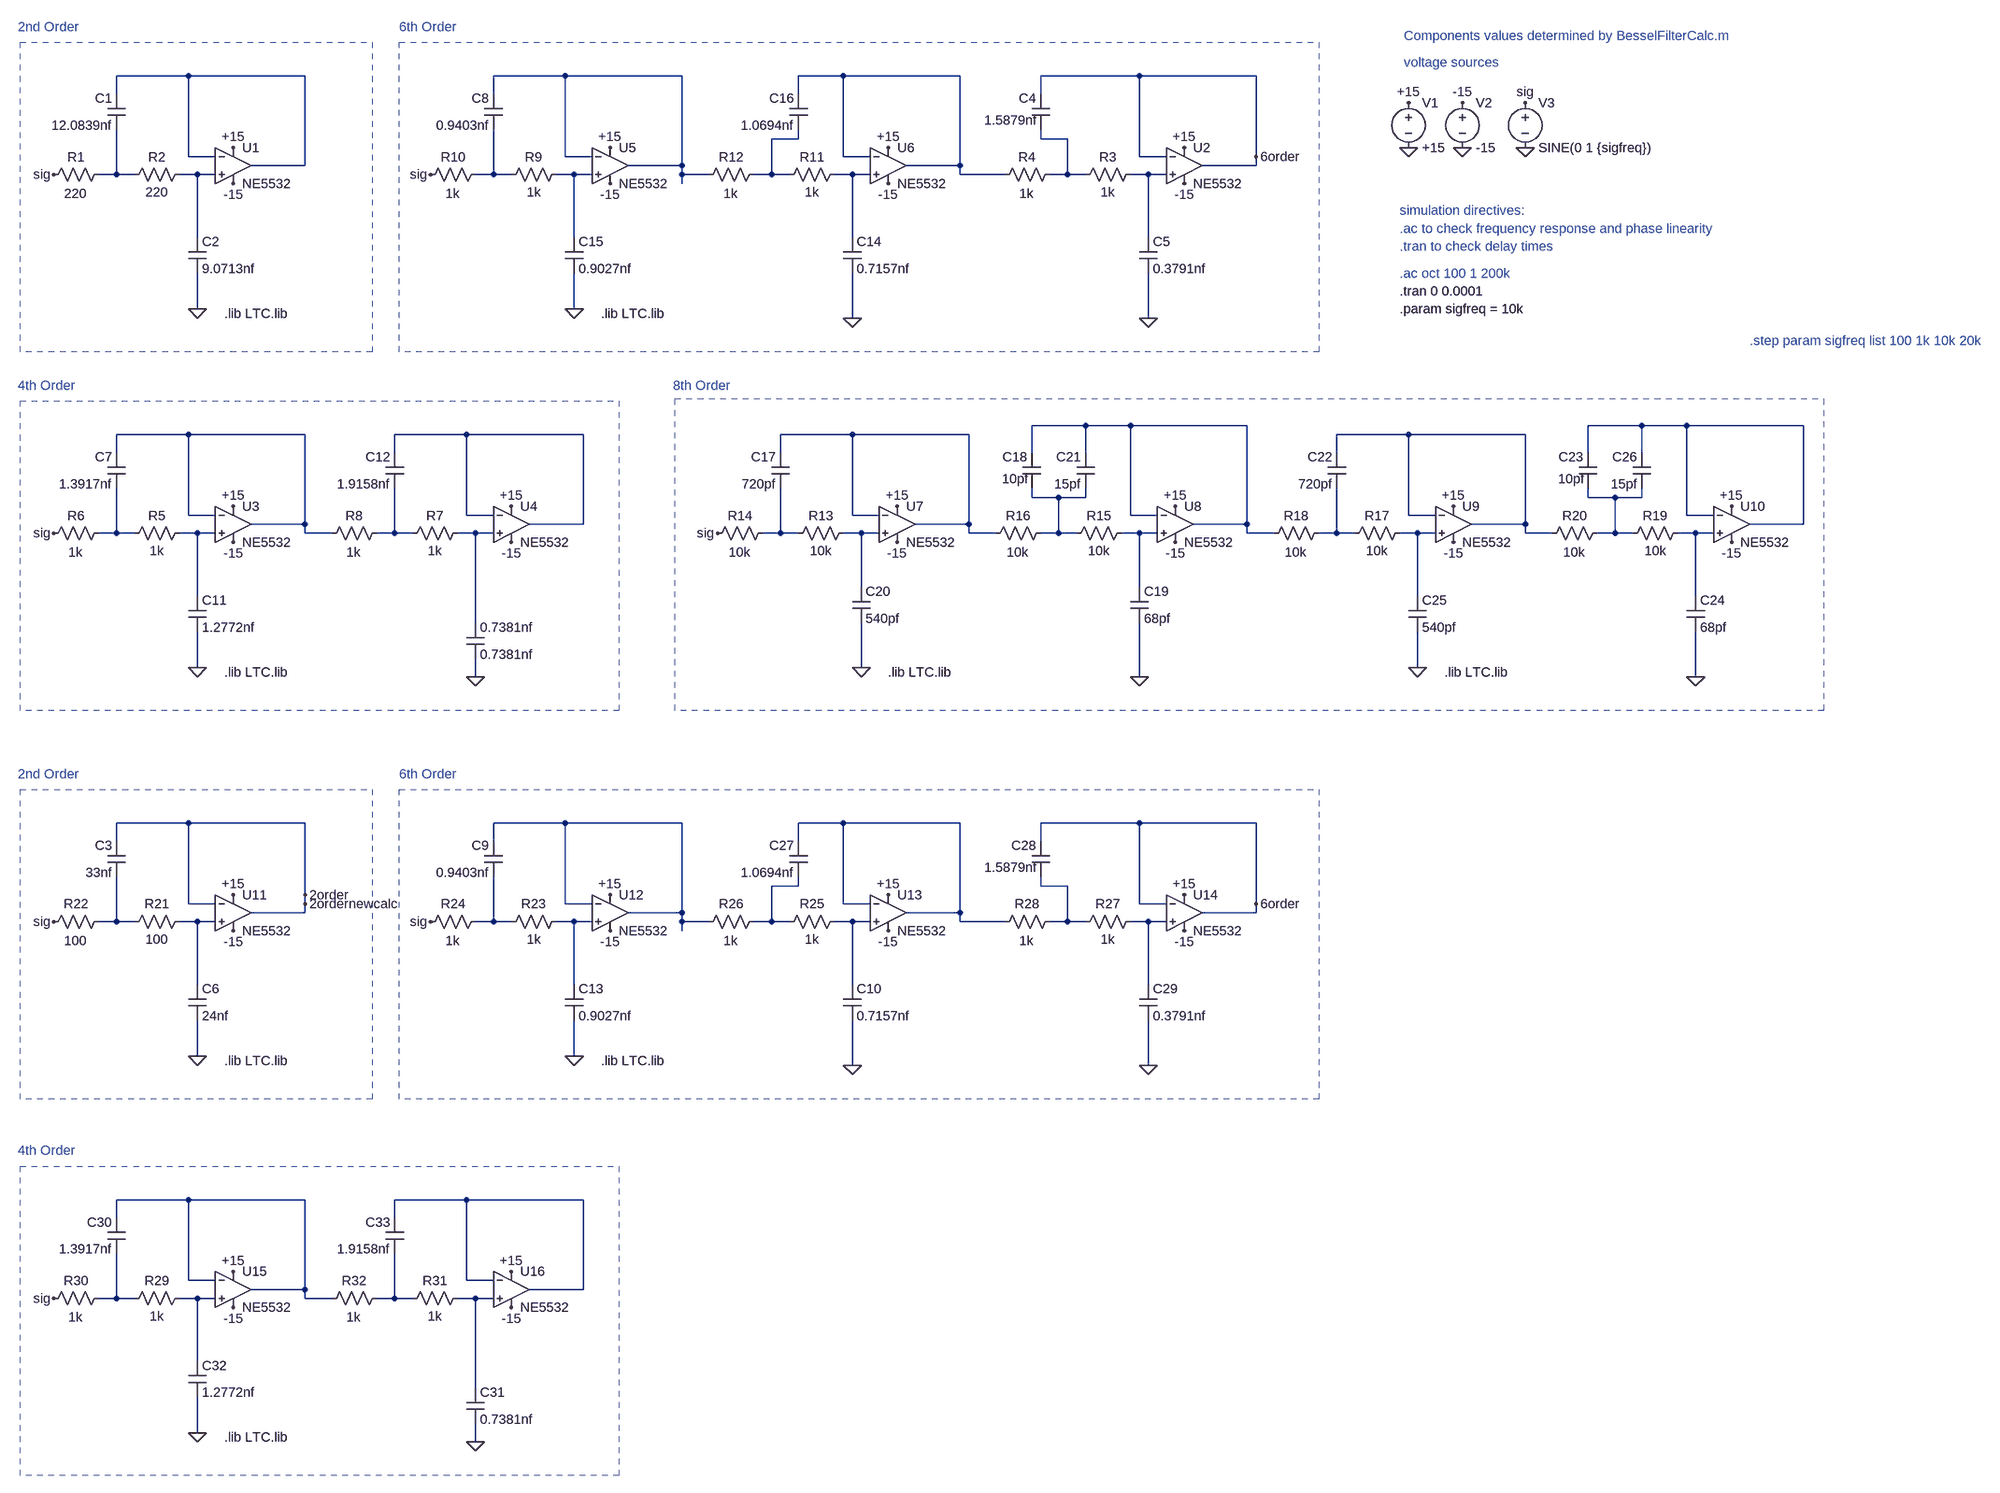
[diagram p0: schematic Bessel Filter.asc]
Bessel Filter.asc, the LTspice schematic file:
Version 4
SHEET 1 4128 2792
WIRE 912 -48 784 -48
WIRE 1120 -48 912 -48
WIRE 1584 -48 1456 -48
WIRE 1792 -48 1584 -48
WIRE 2080 -48 2000 -48
WIRE 2288 -48 2080 -48
WIRE 2608 -48 2432 -48
WIRE 2816 -48 2608 -48
WIRE 784 -16 784 -48
WIRE 1456 -16 1456 -48
WIRE 2000 -16 2000 -48
WIRE 2432 -16 2432 -48
WIRE 2000 64 2000 48
WIRE 2000 64 1952 64
WIRE 2432 64 2432 48
WIRE 2480 64 2432 64
WIRE 912 96 912 -48
WIRE 960 96 912 96
WIRE 1584 96 1584 -48
WIRE 1632 96 1584 96
WIRE 2080 96 2080 -48
WIRE 2128 96 2080 96
WIRE 2608 96 2608 -48
WIRE 2656 96 2608 96
WIRE 2816 96 2816 -48
WIRE 1120 112 1120 -48
WIRE 1120 112 1024 112
WIRE 1792 112 1792 -48
WIRE 1792 112 1696 112
WIRE 2288 112 2288 -48
WIRE 2288 112 2192 112
WIRE 2816 112 2816 96
WIRE 2816 112 2720 112
WIRE 784 128 784 48
WIRE 784 128 752 128
WIRE 816 128 784 128
WIRE 928 128 896 128
WIRE 960 128 928 128
WIRE 1456 128 1456 48
WIRE 1456 128 1424 128
WIRE 1488 128 1456 128
WIRE 1600 128 1568 128
WIRE 1632 128 1600 128
WIRE 1792 128 1792 112
WIRE 1840 128 1792 128
WIRE 1952 128 1952 64
WIRE 1952 128 1920 128
WIRE 1984 128 1952 128
WIRE 2096 128 2064 128
WIRE 2128 128 2096 128
WIRE 2288 128 2288 112
WIRE 2368 128 2288 128
WIRE 2480 128 2480 64
WIRE 2480 128 2448 128
WIRE 2512 128 2480 128
WIRE 2624 128 2592 128
WIRE 2656 128 2624 128
WIRE 1792 144 1792 128
WIRE 928 240 928 128
WIRE 1600 240 1600 128
WIRE 2096 240 2096 128
WIRE 2624 240 2624 128
WIRE 928 368 928 304
WIRE 1600 368 1600 304
WIRE 2096 384 2096 304
WIRE 2624 384 2624 304
WIRE 2512 576 2416 576
WIRE 2592 576 2512 576
WIRE 2800 576 2592 576
WIRE 3504 576 3408 576
WIRE 3584 576 3504 576
WIRE 3792 576 3584 576
WIRE 912 592 784 592
WIRE 1120 592 912 592
WIRE 1408 592 1280 592
WIRE 1616 592 1408 592
WIRE 2096 592 1968 592
WIRE 2304 592 2096 592
WIRE 3088 592 2960 592
WIRE 3296 592 3088 592
WIRE 784 624 784 592
WIRE 1280 624 1280 592
WIRE 1968 624 1968 592
WIRE 2416 624 2416 576
WIRE 2512 624 2512 576
WIRE 2960 624 2960 592
WIRE 3408 624 3408 576
WIRE 3504 624 3504 576
WIRE 2416 704 2416 688
WIRE 2464 704 2416 704
WIRE 2512 704 2512 688
WIRE 2512 704 2464 704
WIRE 3408 704 3408 688
WIRE 3456 704 3408 704
WIRE 3504 704 3504 688
WIRE 3504 704 3456 704
WIRE 912 736 912 592
WIRE 960 736 912 736
WIRE 1408 736 1408 592
WIRE 1456 736 1408 736
WIRE 2096 736 2096 592
WIRE 2144 736 2096 736
WIRE 2592 736 2592 576
WIRE 2640 736 2592 736
WIRE 3088 736 3088 592
WIRE 3136 736 3088 736
WIRE 3584 736 3584 576
WIRE 3632 736 3584 736
WIRE 1120 752 1120 592
WIRE 1120 752 1024 752
WIRE 1616 752 1616 592
WIRE 1616 752 1520 752
WIRE 2304 752 2304 592
WIRE 2304 752 2208 752
WIRE 2800 752 2800 576
WIRE 2800 752 2704 752
WIRE 3296 752 3296 592
WIRE 3296 752 3200 752
WIRE 3792 752 3792 576
WIRE 3792 752 3696 752
WIRE 784 768 784 688
WIRE 784 768 752 768
WIRE 816 768 784 768
WIRE 928 768 896 768
WIRE 960 768 928 768
WIRE 1120 768 1120 752
WIRE 1168 768 1120 768
WIRE 1280 768 1280 688
WIRE 1280 768 1248 768
WIRE 1312 768 1280 768
WIRE 1424 768 1392 768
WIRE 1456 768 1424 768
WIRE 1968 768 1968 688
WIRE 1968 768 1936 768
WIRE 2000 768 1968 768
WIRE 2112 768 2080 768
WIRE 2144 768 2112 768
WIRE 2304 768 2304 752
WIRE 2352 768 2304 768
WIRE 2464 768 2464 704
WIRE 2464 768 2432 768
WIRE 2496 768 2464 768
WIRE 2608 768 2576 768
WIRE 2640 768 2608 768
WIRE 2800 768 2800 752
WIRE 2848 768 2800 768
WIRE 2960 768 2960 688
WIRE 2960 768 2928 768
WIRE 2992 768 2960 768
WIRE 3104 768 3072 768
WIRE 3136 768 3104 768
WIRE 3296 768 3296 752
WIRE 3344 768 3296 768
WIRE 3456 768 3456 704
WIRE 3456 768 3424 768
WIRE 3488 768 3456 768
WIRE 3600 768 3568 768
WIRE 3632 768 3600 768
WIRE 2112 864 2112 768
WIRE 2608 864 2608 768
WIRE 928 880 928 768
WIRE 3104 880 3104 768
WIRE 3600 880 3600 768
WIRE 1424 928 1424 768
WIRE 928 1008 928 944
WIRE 2112 1008 2112 928
WIRE 3104 1008 3104 944
WIRE 1424 1024 1424 992
WIRE 2608 1024 2608 928
WIRE 3600 1024 3600 944
WIRE 912 1392 784 1392
WIRE 1120 1392 912 1392
WIRE 1584 1392 1456 1392
WIRE 1792 1392 1584 1392
WIRE 2080 1392 2000 1392
WIRE 2288 1392 2080 1392
WIRE 2608 1392 2432 1392
WIRE 2816 1392 2608 1392
WIRE 784 1424 784 1392
WIRE 1456 1424 1456 1392
WIRE 2000 1424 2000 1392
WIRE 2432 1424 2432 1392
WIRE 2000 1504 2000 1488
WIRE 2000 1504 1952 1504
WIRE 2432 1504 2432 1488
WIRE 2480 1504 2432 1504
WIRE 1120 1520 1120 1392
WIRE 912 1536 912 1392
WIRE 960 1536 912 1536
WIRE 1120 1536 1120 1520
WIRE 1584 1536 1584 1392
WIRE 1632 1536 1584 1536
WIRE 2080 1536 2080 1392
WIRE 2128 1536 2080 1536
WIRE 2608 1536 2608 1392
WIRE 2656 1536 2608 1536
WIRE 2816 1536 2816 1392
WIRE 1120 1552 1120 1536
WIRE 1120 1552 1024 1552
WIRE 1792 1552 1792 1392
WIRE 1792 1552 1696 1552
WIRE 2288 1552 2288 1392
WIRE 2288 1552 2192 1552
WIRE 2816 1552 2816 1536
WIRE 2816 1552 2720 1552
WIRE 784 1568 784 1488
WIRE 784 1568 752 1568
WIRE 816 1568 784 1568
WIRE 928 1568 896 1568
WIRE 960 1568 928 1568
WIRE 1456 1568 1456 1488
WIRE 1456 1568 1424 1568
WIRE 1488 1568 1456 1568
WIRE 1600 1568 1568 1568
WIRE 1632 1568 1600 1568
WIRE 1792 1568 1792 1552
WIRE 1840 1568 1792 1568
WIRE 1952 1568 1952 1504
WIRE 1952 1568 1920 1568
WIRE 1984 1568 1952 1568
WIRE 2096 1568 2064 1568
WIRE 2128 1568 2096 1568
WIRE 2288 1568 2288 1552
WIRE 2368 1568 2288 1568
WIRE 2480 1568 2480 1504
WIRE 2480 1568 2448 1568
WIRE 2512 1568 2480 1568
WIRE 2624 1568 2592 1568
WIRE 2656 1568 2624 1568
WIRE 1792 1584 1792 1568
WIRE 928 1680 928 1568
WIRE 1600 1680 1600 1568
WIRE 2096 1680 2096 1568
WIRE 2624 1680 2624 1568
WIRE 928 1808 928 1744
WIRE 1600 1808 1600 1744
WIRE 2096 1824 2096 1744
WIRE 2624 1824 2624 1744
WIRE 912 2064 784 2064
WIRE 1120 2064 912 2064
WIRE 1408 2064 1280 2064
WIRE 1616 2064 1408 2064
WIRE 784 2096 784 2064
WIRE 1280 2096 1280 2064
WIRE 912 2208 912 2064
WIRE 960 2208 912 2208
WIRE 1408 2208 1408 2064
WIRE 1456 2208 1408 2208
WIRE 1120 2224 1120 2064
WIRE 1120 2224 1024 2224
WIRE 1616 2224 1616 2064
WIRE 1616 2224 1520 2224
WIRE 784 2240 784 2160
WIRE 784 2240 752 2240
WIRE 816 2240 784 2240
WIRE 928 2240 896 2240
WIRE 960 2240 928 2240
WIRE 1120 2240 1120 2224
WIRE 1168 2240 1120 2240
WIRE 1280 2240 1280 2160
WIRE 1280 2240 1248 2240
WIRE 1312 2240 1280 2240
WIRE 1424 2240 1392 2240
WIRE 1456 2240 1424 2240
WIRE 928 2352 928 2240
WIRE 1424 2400 1424 2240
WIRE 928 2480 928 2416
WIRE 1424 2496 1424 2464
FLAG 3088 80 0
FLAG 3184 80 0
FLAG 3296 80 0
FLAG 3088 0 +15
FLAG 992 80 +15
FLAG 3184 0 -15
FLAG 992 144 -15
FLAG 928 368 0
FLAG 3296 0 sig
FLAG 672 128 sig
FLAG 992 720 +15
FLAG 992 784 -15
FLAG 1488 720 +15
FLAG 1488 784 -15
FLAG 1424 1024 0
FLAG 928 1008 0
FLAG 672 768 sig
FLAG 1664 80 +15
FLAG 1664 144 -15
FLAG 2160 80 +15
FLAG 2160 144 -15
FLAG 2096 384 0
FLAG 1600 368 0
FLAG 1344 128 sig
FLAG 2176 720 +15
FLAG 2176 784 -15
FLAG 2672 720 +15
FLAG 2672 784 -15
FLAG 2608 1024 0
FLAG 2112 1008 0
FLAG 1856 768 sig
FLAG 2688 80 +15
FLAG 2688 144 -15
FLAG 2624 384 0
FLAG 3168 720 +15
FLAG 3168 784 -15
FLAG 3664 720 +15
FLAG 3664 784 -15
FLAG 3600 1024 0
FLAG 3104 1008 0
FLAG 2816 96 6order
FLAG 992 1520 +15
FLAG 992 1584 -15
FLAG 928 1808 0
FLAG 672 1568 sig
FLAG 1664 1520 +15
FLAG 1664 1584 -15
FLAG 2160 1520 +15
FLAG 2160 1584 -15
FLAG 2096 1824 0
FLAG 1600 1808 0
FLAG 1344 1568 sig
FLAG 2688 1520 +15
FLAG 2688 1584 -15
FLAG 2624 1824 0
FLAG 2816 1536 6order
FLAG 1120 1520 2order
FLAG 992 2192 +15
FLAG 992 2256 -15
FLAG 1488 2192 +15
FLAG 1488 2256 -15
FLAG 1424 2496 0
FLAG 928 2480 0
FLAG 672 2240 sig
FLAG 1120 1536 2ordernewcalc
SYMBOL cap 800 48 R180
WINDOW 0 24 56 Left 2
WINDOW 3 24 8 Left 2
SYMATTR InstName C1
SYMATTR Value 12.0839nf
SYMBOL cap 912 240 R0
SYMATTR InstName C2
SYMATTR Value 9.0713nf
SYMBOL res 912 112 R90
WINDOW 0 0 56 VBottom 2
WINDOW 3 32 56 VTop 2
SYMATTR InstName R2
SYMATTR Value 220
SYMBOL res 768 112 R90
WINDOW 0 0 56 VBottom 2
WINDOW 3 34 57 VTop 2
SYMATTR InstName R1
SYMATTR Value 220
SYMBOL OpAmps/opamp2 992 48 R0
SYMATTR InstName U1
SYMATTR Value NE5532
SYMBOL voltage 3088 -16 R0
SYMATTR InstName V1
SYMATTR Value +15
SYMBOL voltage 3184 -16 R0
SYMATTR InstName V2
SYMATTR Value -15
SYMBOL voltage 3296 -16 R0
SYMATTR InstName V3
SYMATTR Value SINE(0 1 {sigfreq})
SYMATTR Value2 AC 1
SYMBOL cap 800 688 R180
WINDOW 0 24 56 Left 2
WINDOW 3 24 8 Left 2
SYMATTR InstName C7
SYMATTR Value 1.3917nf
SYMBOL res 912 752 R90
WINDOW 0 0 56 VBottom 2
WINDOW 3 32 56 VTop 2
SYMATTR InstName R5
SYMATTR Value 1k
SYMBOL res 768 752 R90
WINDOW 0 0 56 VBottom 2
WINDOW 3 34 57 VTop 2
SYMATTR InstName R6
SYMATTR Value 1k
SYMBOL OpAmps/opamp2 992 688 R0
SYMATTR InstName U3
SYMATTR Value NE5532
SYMBOL cap 1408 928 R0
SYMATTR InstName 0.7381nf
SYMATTR Value 0.7381nf
SYMBOL res 1408 752 R90
WINDOW 0 0 56 VBottom 2
WINDOW 3 32 56 VTop 2
SYMATTR InstName R7
SYMATTR Value 1k
SYMBOL res 1264 752 R90
WINDOW 0 0 56 VBottom 2
WINDOW 3 34 57 VTop 2
SYMATTR InstName R8
SYMATTR Value 1k
SYMBOL OpAmps/opamp2 1488 688 R0
SYMATTR InstName U4
SYMATTR Value NE5532
SYMBOL cap 912 880 R0
SYMATTR InstName C11
SYMATTR Value 1.2772nf
SYMBOL cap 1296 688 R180
WINDOW 0 24 56 Left 2
WINDOW 3 24 8 Left 2
SYMATTR InstName C12
SYMATTR Value 1.9158nf
SYMBOL cap 1472 48 R180
WINDOW 0 24 56 Left 2
WINDOW 3 24 8 Left 2
SYMATTR InstName C8
SYMATTR Value 0.9403nf
SYMBOL res 1584 112 R90
WINDOW 0 0 56 VBottom 2
WINDOW 3 32 56 VTop 2
SYMATTR InstName R9
SYMATTR Value 1k
SYMBOL res 1440 112 R90
WINDOW 0 0 56 VBottom 2
WINDOW 3 34 57 VTop 2
SYMATTR InstName R10
SYMATTR Value 1k
SYMBOL OpAmps/opamp2 1664 48 R0
SYMATTR InstName U5
SYMATTR Value NE5532
SYMBOL cap 2080 240 R0
SYMATTR InstName C14
SYMATTR Value 0.7157nf
SYMBOL res 2080 112 R90
WINDOW 0 0 56 VBottom 2
WINDOW 3 32 56 VTop 2
SYMATTR InstName R11
SYMATTR Value 1k
SYMBOL res 1936 112 R90
WINDOW 0 0 56 VBottom 2
WINDOW 3 34 57 VTop 2
SYMATTR InstName R12
SYMATTR Value 1k
SYMBOL OpAmps/opamp2 2160 48 R0
SYMATTR InstName U6
SYMATTR Value NE5532
SYMBOL cap 1584 240 R0
SYMATTR InstName C15
SYMATTR Value 0.9027nf
SYMBOL cap 2016 48 R180
WINDOW 0 24 56 Left 2
WINDOW 3 24 8 Left 2
SYMATTR InstName C16
SYMATTR Value 1.0694nf
SYMBOL cap 1984 688 R180
WINDOW 0 24 56 Left 2
WINDOW 3 24 8 Left 2
SYMATTR InstName C17
SYMATTR Value 720pf
SYMBOL res 2096 752 R90
WINDOW 0 0 56 VBottom 2
WINDOW 3 32 56 VTop 2
SYMATTR InstName R13
SYMATTR Value 10k
SYMBOL res 1952 752 R90
WINDOW 0 0 56 VBottom 2
WINDOW 3 34 57 VTop 2
SYMATTR InstName R14
SYMATTR Value 10k
SYMBOL OpAmps/opamp2 2176 688 R0
SYMATTR InstName U7
SYMATTR Value NE5532
SYMBOL cap 2432 688 R180
WINDOW 0 24 56 Left 2
WINDOW 3 22 17 Left 2
SYMATTR InstName C18
SYMATTR Value 10pf
SYMBOL cap 2592 864 R0
SYMATTR InstName C19
SYMATTR Value 68pf
SYMBOL res 2592 752 R90
WINDOW 0 0 56 VBottom 2
WINDOW 3 32 56 VTop 2
SYMATTR InstName R15
SYMATTR Value 10k
SYMBOL res 2448 752 R90
WINDOW 0 0 56 VBottom 2
WINDOW 3 34 57 VTop 2
SYMATTR InstName R16
SYMATTR Value 10k
SYMBOL OpAmps/opamp2 2672 688 R0
SYMATTR InstName U8
SYMATTR Value NE5532
SYMBOL cap 2096 864 R0
SYMATTR InstName C20
SYMATTR Value 540pf
SYMBOL cap 2528 688 R180
WINDOW 0 24 56 Left 2
WINDOW 3 24 8 Left 2
SYMATTR InstName C21
SYMATTR Value 15pf
SYMBOL cap 2448 48 R180
WINDOW 0 24 56 Left 2
WINDOW 3 22 17 Left 2
SYMATTR InstName C4
SYMATTR Value 1.5879nf
SYMBOL cap 2608 240 R0
SYMATTR InstName C5
SYMATTR Value 0.3791nf
SYMBOL res 2608 112 R90
WINDOW 0 0 56 VBottom 2
WINDOW 3 32 56 VTop 2
SYMATTR InstName R3
SYMATTR Value 1k
SYMBOL res 2464 112 R90
WINDOW 0 0 56 VBottom 2
WINDOW 3 34 57 VTop 2
SYMATTR InstName R4
SYMATTR Value 1k
SYMBOL OpAmps/opamp2 2688 48 R0
SYMATTR InstName U2
SYMATTR Value NE5532
SYMBOL cap 2976 688 R180
WINDOW 0 24 56 Left 2
WINDOW 3 24 8 Left 2
SYMATTR InstName C22
SYMATTR Value 720pf
SYMBOL res 3088 752 R90
WINDOW 0 0 56 VBottom 2
WINDOW 3 32 56 VTop 2
SYMATTR InstName R17
SYMATTR Value 10k
SYMBOL res 2944 752 R90
WINDOW 0 0 56 VBottom 2
WINDOW 3 34 57 VTop 2
SYMATTR InstName R18
SYMATTR Value 10k
SYMBOL OpAmps/opamp2 3168 688 R0
SYMATTR InstName U9
SYMATTR Value NE5532
SYMBOL cap 3424 688 R180
WINDOW 0 24 56 Left 2
WINDOW 3 22 17 Left 2
SYMATTR InstName C23
SYMATTR Value 10pf
SYMBOL cap 3584 880 R0
SYMATTR InstName C24
SYMATTR Value 68pf
SYMBOL res 3584 752 R90
WINDOW 0 0 56 VBottom 2
WINDOW 3 32 56 VTop 2
SYMATTR InstName R19
SYMATTR Value 10k
SYMBOL res 3440 752 R90
WINDOW 0 0 56 VBottom 2
WINDOW 3 34 57 VTop 2
SYMATTR InstName R20
SYMATTR Value 10k
SYMBOL OpAmps/opamp2 3664 688 R0
SYMATTR InstName U10
SYMATTR Value NE5532
SYMBOL cap 3088 880 R0
SYMATTR InstName C25
SYMATTR Value 540pf
SYMBOL cap 3520 688 R180
WINDOW 0 24 56 Left 2
WINDOW 3 24 8 Left 2
SYMATTR InstName C26
SYMATTR Value 15pf
SYMBOL cap 800 1488 R180
WINDOW 0 24 56 Left 2
WINDOW 3 24 8 Left 2
SYMATTR InstName C3
SYMATTR Value 33nf
SYMBOL cap 912 1680 R0
SYMATTR InstName C6
SYMATTR Value 24nf
SYMBOL res 912 1552 R90
WINDOW 0 0 56 VBottom 2
WINDOW 3 32 56 VTop 2
SYMATTR InstName R21
SYMATTR Value 100
SYMBOL res 768 1552 R90
WINDOW 0 0 56 VBottom 2
WINDOW 3 34 57 VTop 2
SYMATTR InstName R22
SYMATTR Value 100
SYMBOL OpAmps/opamp2 992 1488 R0
SYMATTR InstName U11
SYMATTR Value NE5532
SYMBOL cap 1472 1488 R180
WINDOW 0 24 56 Left 2
WINDOW 3 24 8 Left 2
SYMATTR InstName C9
SYMATTR Value 0.9403nf
SYMBOL res 1584 1552 R90
WINDOW 0 0 56 VBottom 2
WINDOW 3 32 56 VTop 2
SYMATTR InstName R23
SYMATTR Value 1k
SYMBOL res 1440 1552 R90
WINDOW 0 0 56 VBottom 2
WINDOW 3 34 57 VTop 2
SYMATTR InstName R24
SYMATTR Value 1k
SYMBOL OpAmps/opamp2 1664 1488 R0
SYMATTR InstName U12
SYMATTR Value NE5532
SYMBOL cap 2080 1680 R0
SYMATTR InstName C10
SYMATTR Value 0.7157nf
SYMBOL res 2080 1552 R90
WINDOW 0 0 56 VBottom 2
WINDOW 3 32 56 VTop 2
SYMATTR InstName R25
SYMATTR Value 1k
SYMBOL res 1936 1552 R90
WINDOW 0 0 56 VBottom 2
WINDOW 3 34 57 VTop 2
SYMATTR InstName R26
SYMATTR Value 1k
SYMBOL OpAmps/opamp2 2160 1488 R0
SYMATTR InstName U13
SYMATTR Value NE5532
SYMBOL cap 1584 1680 R0
SYMATTR InstName C13
SYMATTR Value 0.9027nf
SYMBOL cap 2016 1488 R180
WINDOW 0 24 56 Left 2
WINDOW 3 24 8 Left 2
SYMATTR InstName C27
SYMATTR Value 1.0694nf
SYMBOL cap 2448 1488 R180
WINDOW 0 24 56 Left 2
WINDOW 3 22 17 Left 2
SYMATTR InstName C28
SYMATTR Value 1.5879nf
SYMBOL cap 2608 1680 R0
SYMATTR InstName C29
SYMATTR Value 0.3791nf
SYMBOL res 2608 1552 R90
WINDOW 0 0 56 VBottom 2
WINDOW 3 32 56 VTop 2
SYMATTR InstName R27
SYMATTR Value 1k
SYMBOL res 2464 1552 R90
WINDOW 0 0 56 VBottom 2
WINDOW 3 34 57 VTop 2
SYMATTR InstName R28
SYMATTR Value 1k
SYMBOL OpAmps/opamp2 2688 1488 R0
SYMATTR InstName U14
SYMATTR Value NE5532
SYMBOL cap 800 2160 R180
WINDOW 0 24 56 Left 2
WINDOW 3 24 8 Left 2
SYMATTR InstName C30
SYMATTR Value 1.3917nf
SYMBOL res 912 2224 R90
WINDOW 0 0 56 VBottom 2
WINDOW 3 32 56 VTop 2
SYMATTR InstName R29
SYMATTR Value 1k
SYMBOL res 768 2224 R90
WINDOW 0 0 56 VBottom 2
WINDOW 3 34 57 VTop 2
SYMATTR InstName R30
SYMATTR Value 1k
SYMBOL OpAmps/opamp2 992 2160 R0
SYMATTR InstName U15
SYMATTR Value NE5532
SYMBOL cap 1408 2400 R0
SYMATTR InstName C31
SYMATTR Value 0.7381nf
SYMBOL res 1408 2224 R90
WINDOW 0 0 56 VBottom 2
WINDOW 3 32 56 VTop 2
SYMATTR InstName R31
SYMATTR Value 1k
SYMBOL res 1264 2224 R90
WINDOW 0 0 56 VBottom 2
WINDOW 3 34 57 VTop 2
SYMATTR InstName R32
SYMATTR Value 1k
SYMBOL OpAmps/opamp2 1488 2160 R0
SYMATTR InstName U16
SYMATTR Value NE5532
SYMBOL cap 912 2352 R0
SYMATTR InstName C32
SYMATTR Value 1.2772nf
SYMBOL cap 1296 2160 R180
WINDOW 0 24 56 Left 2
WINDOW 3 24 8 Left 2
SYMATTR InstName C33
SYMATTR Value 1.9158nf
TEXT 976 376 Left 2 !.lib LTC.lib
TEXT 3072 304 Left 2 ;.ac oct 100 1 200k
TEXT 3072 336 Left 2 !.tran 0 0.0001
TEXT 608 -136 Left 2 ;2nd Order
TEXT 3080 -72 Left 2 ;voltage sources
TEXT 3072 192 Left 2 ;simulation directives:
TEXT 976 1016 Left 2 !.lib LTC.lib
TEXT 608 504 Left 2 ;4th Order
TEXT 1648 376 Left 2 !.lib LTC.lib
TEXT 1288 -136 Left 2 ;6th Order
TEXT 2160 1016 Left 2 !.lib LTC.lib
TEXT 1776 504 Left 2 ;8th Order
TEXT 3152 1016 Left 2 !.lib LTC.lib
TEXT 3080 -120 Left 2 ;Components values determined by BesselFilterCalc.m
TEXT 976 1816 Left 2 !.lib LTC.lib
TEXT 608 1304 Left 2 ;2nd Order
TEXT 1648 1816 Left 2 !.lib LTC.lib
TEXT 1288 1304 Left 2 ;6th Order
TEXT 976 2488 Left 2 !.lib LTC.lib
TEXT 608 1976 Left 2 ;4th Order
TEXT 3072 256 Left 2 ;.tran to check delay times
TEXT 3072 224 Left 2 ;.ac to check frequency response and phase linearity
TEXT 3696 424 Left 2 ;.step param sigfreq list 100 1k 10k 20k
TEXT 3072 368 Left 2 !.param sigfreq = 10k
RECTANGLE Normal 612 -108 1240 444 2
RECTANGLE Normal 1288 -108 2928 444 2
RECTANGLE Normal 1680 1084 612 532 2
RECTANGLE Normal 1780 528 3828 1084 2
RECTANGLE Normal 612 1332 1240 1884 2
RECTANGLE Normal 1288 1332 2928 1884 2
RECTANGLE Normal 1680 2556 612 2004 2

The netlist it stands for:
* Bessel Filter.asc
C1 N006 N001 12.0839nf
C2 N007 0 9.0713nf
R2 N007 N006 220
R1 N006 sig 220
XU1 N007 N001 +15 -15 N001 NE5532  ; pins In+ In- V+ V- OUT
V1 +15 0 +15
V2 -15 0 -15
V3 sig 0 SINE(0 1 {sigfreq}) AC 1
C7 N020 N014 1.3917nf
R5 N021 N020 1k
R6 N020 sig 1k
XU3 N021 N014 +15 -15 N014 NE5532  ; pins In+ In- V+ V- OUT
C§0.7381nf N023 0 0.7381nf
R7 N023 N022 1k
R8 N022 N014 1k
XU4 N023 N015 +15 -15 N015 NE5532  ; pins In+ In- V+ V- OUT
C11 N021 0 1.2772nf
C12 N022 N015 1.9158nf
C8 N008 N002 0.9403nf
R9 N009 N008 1k
R10 N008 sig 1k
XU5 N009 N002 +15 -15 N002 NE5532  ; pins In+ In- V+ V- OUT
C14 N010 0 0.7157nf
R11 N010 N004 1k
R12 N004 N002 1k
XU6 N010 N003 +15 -15 N003 NE5532  ; pins In+ In- V+ V- OUT
C15 N009 0 0.9027nf
C16 N004 N003 1.0694nf
C17 N024 N016 720pf
R13 N025 N024 10k
R14 N024 sig 10k
XU7 N025 N016 +15 -15 N016 NE5532  ; pins In+ In- V+ V- OUT
C18 N018 N012 10pf
C19 N026 0 68pf
R15 N026 N018 10k
R16 N018 N016 10k
XU8 N026 N012 +15 -15 N012 NE5532  ; pins In+ In- V+ V- OUT
C20 N025 0 540pf
C21 N018 N012 15pf
C4 N005 6order 1.5879nf
C5 N011 0 0.3791nf
R3 N011 N005 1k
R4 N005 N003 1k
XU2 N011 6order +15 -15 6order NE5532  ; pins In+ In- V+ V- OUT
C22 N027 N017 720pf
R17 N028 N027 10k
R18 N027 N012 10k
XU9 N028 N017 +15 -15 N017 NE5532  ; pins In+ In- V+ V- OUT
C23 N019 N013 10pf
C24 N029 0 68pf
R19 N029 N019 10k
R20 N019 N017 10k
XU10 N029 N013 +15 -15 N013 NE5532  ; pins In+ In- V+ V- OUT
C25 N028 0 540pf
C26 N019 N013 15pf
C3 N034 2ordernewcalc 33nf
C6 N035 0 24nf
R21 N035 N034 100
R22 N034 sig 100
XU11 N035 2ordernewcalc +15 -15 2ordernewcalc NE5532  ; pins In+ In- V+ V- OUT
C9 N036 N030 0.9403nf
R23 N037 N036 1k
R24 N036 sig 1k
XU12 N037 N030 +15 -15 N030 NE5532  ; pins In+ In- V+ V- OUT
C10 N038 0 0.7157nf
R25 N038 N032 1k
R26 N032 N030 1k
XU13 N038 N031 +15 -15 N031 NE5532  ; pins In+ In- V+ V- OUT
C13 N037 0 0.9027nf
C27 N032 N031 1.0694nf
C28 N033 6order 1.5879nf
C29 N039 0 0.3791nf
R27 N039 N033 1k
R28 N033 N031 1k
XU14 N039 6order +15 -15 6order NE5532  ; pins In+ In- V+ V- OUT
C30 N042 N040 1.3917nf
R29 N043 N042 1k
R30 N042 sig 1k
XU15 N043 N040 +15 -15 N040 NE5532  ; pins In+ In- V+ V- OUT
C31 N045 0 0.7381nf
R31 N045 N044 1k
R32 N044 N040 1k
XU16 N045 N041 +15 -15 N041 NE5532  ; pins In+ In- V+ V- OUT
C32 N043 0 1.2772nf
C33 N044 N041 1.9158nf
.lib LTC.lib
* .ac oct 100 1 200k
.tran 0 0.0001
* 2nd Order
* voltage sources
* simulation directives:
.lib LTC.lib
* 4th Order
.lib LTC.lib
* 6th Order
.lib LTC.lib
* 8th Order
.lib LTC.lib
* Components values determined by BesselFilterCalc.m
.lib LTC.lib
* 2nd Order
.lib LTC.lib
* 6th Order
.lib LTC.lib
* 4th Order
* .tran to check delay times
* .ac to check frequency response and phase linearity
* .step param sigfreq list 100 1k 10k 20k
.param sigfreq = 10k
.backanno
.end